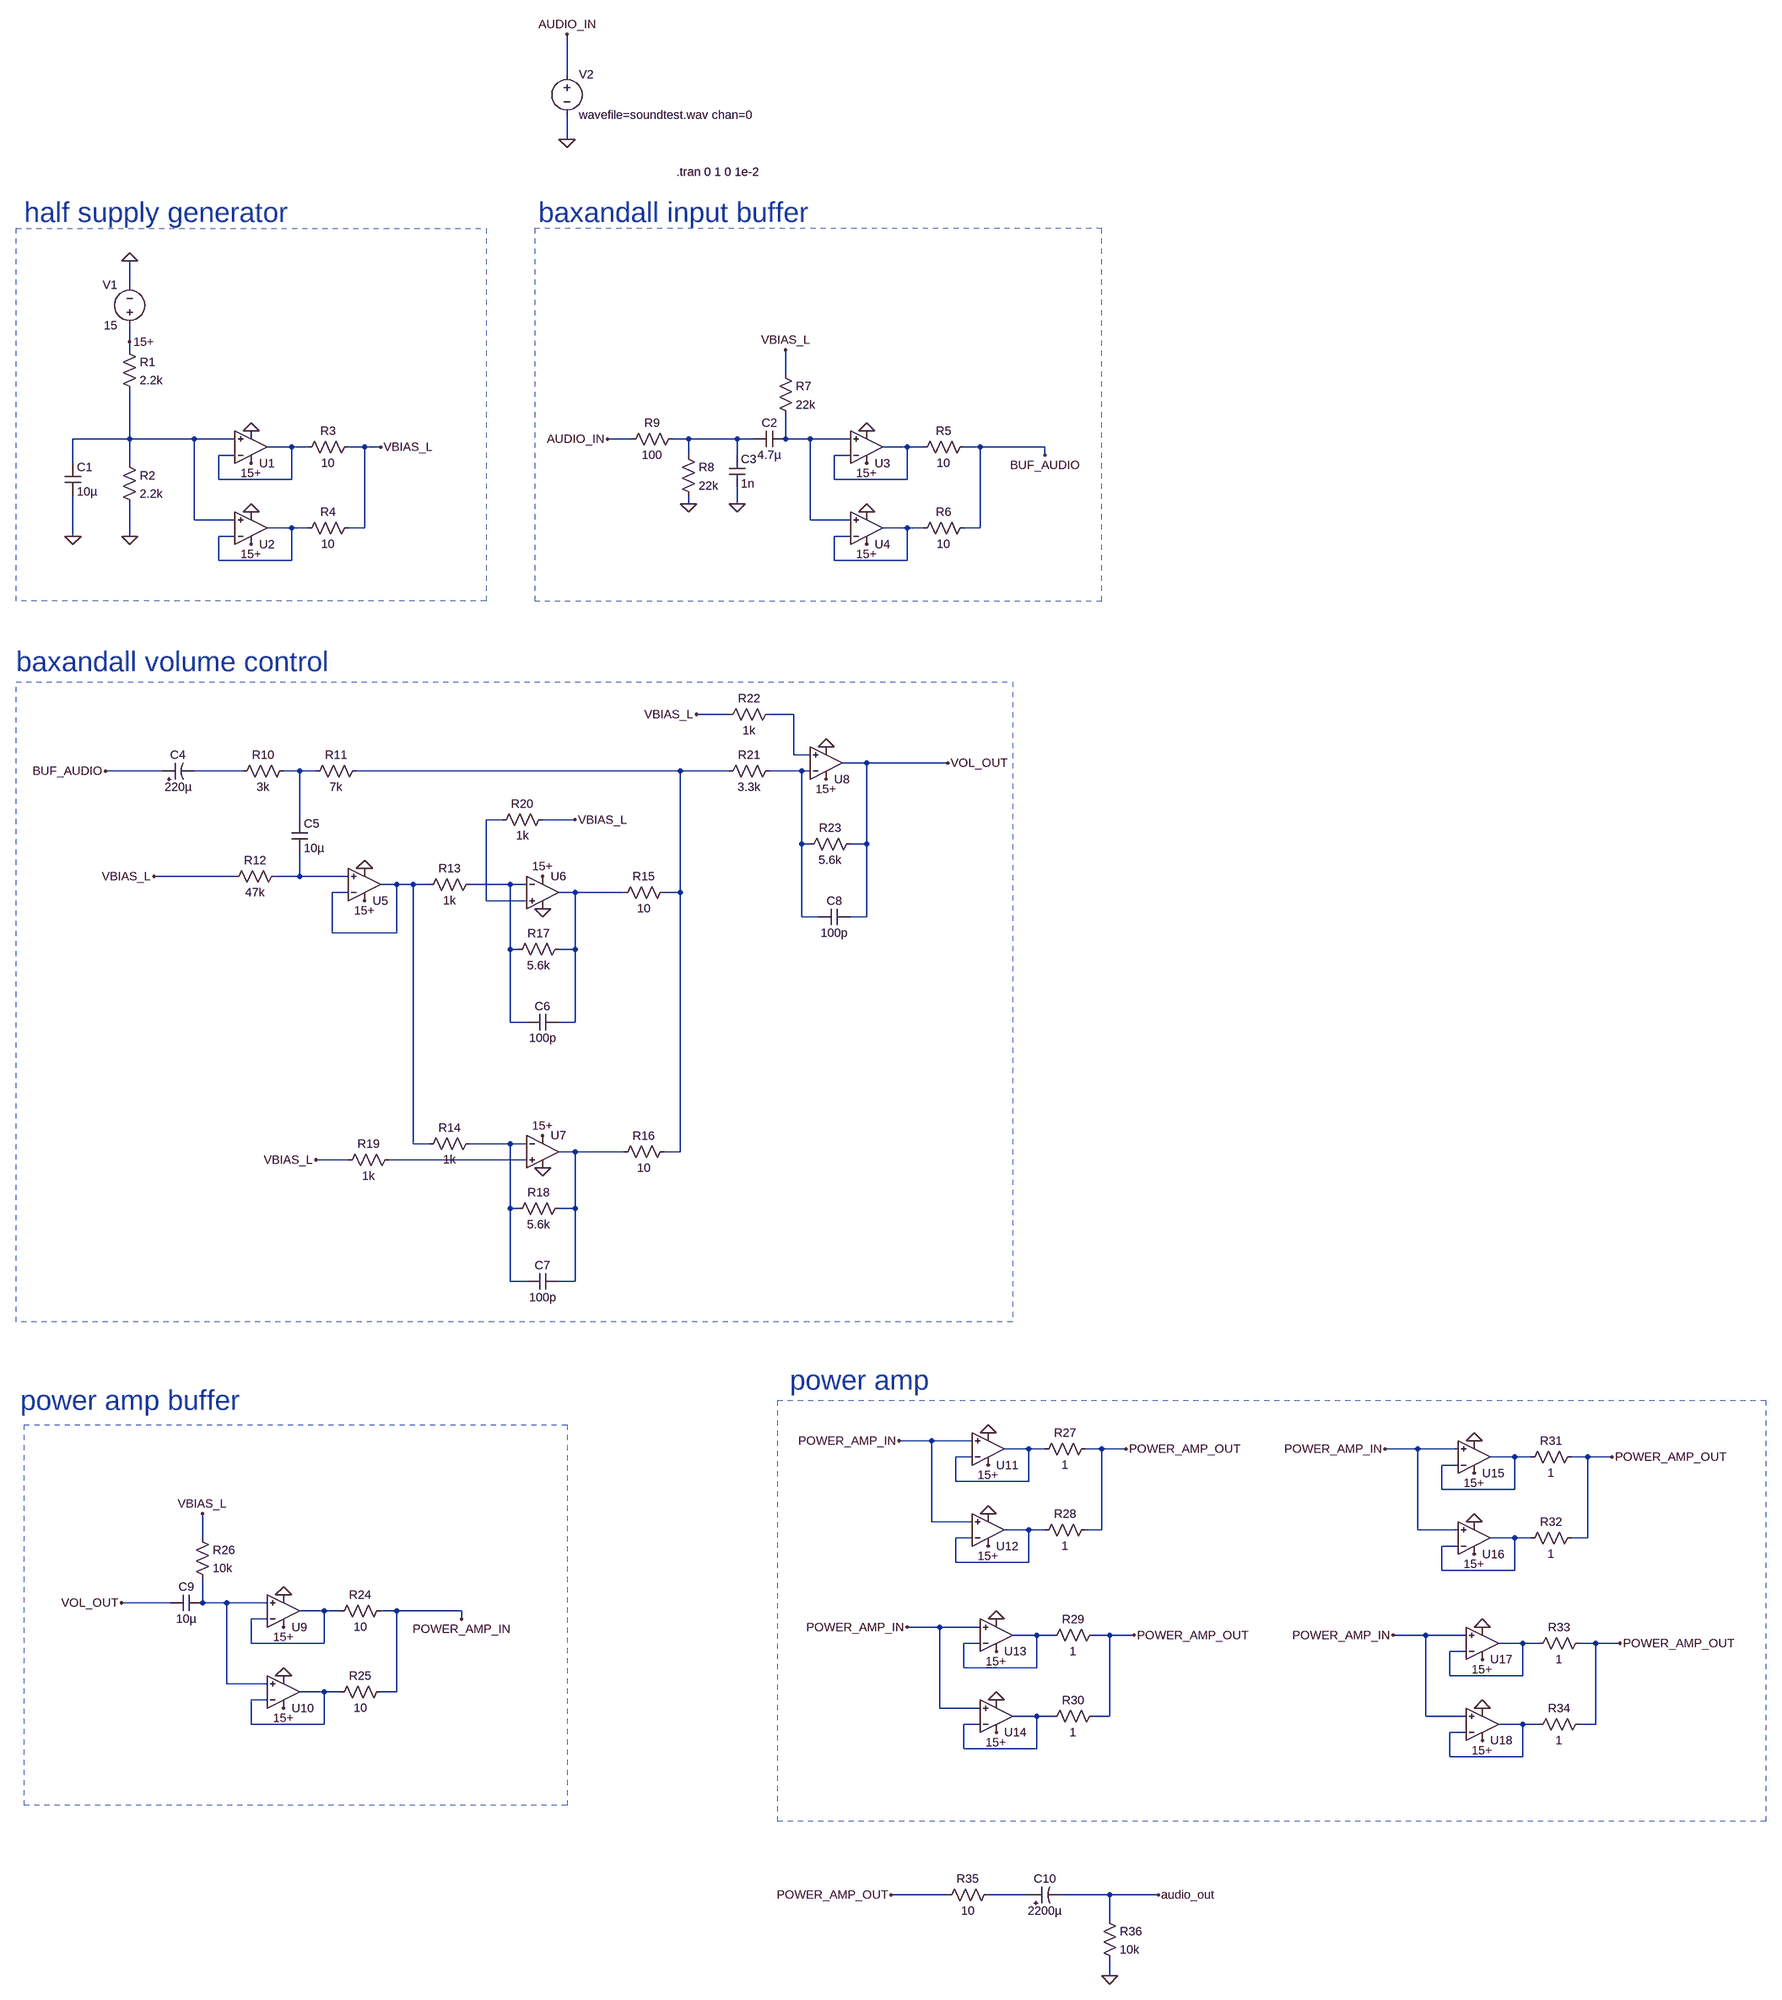
[diagram p0: schematic Amp sim backup.asc]
Amp sim backup.asc, the LTspice schematic file:
Version 4
SHEET 1 1124 932
WIRE -1248 -2864 -1248 -2944
WIRE -1248 -2736 -1248 -2784
WIRE -2112 -2448 -2112 -2496
WIRE -2112 -2336 -2112 -2368
WIRE -2112 -2320 -2112 -2336
WIRE -816 -2272 -816 -2320
WIRE -2112 -2144 -2112 -2240
WIRE -2112 -2144 -2224 -2144
WIRE -1984 -2144 -2112 -2144
WIRE -1904 -2144 -1984 -2144
WIRE -1120 -2144 -1168 -2144
WIRE -1008 -2144 -1040 -2144
WIRE -912 -2144 -1008 -2144
WIRE -880 -2144 -912 -2144
WIRE -816 -2144 -816 -2192
WIRE -768 -2144 -816 -2144
WIRE -688 -2144 -768 -2144
WIRE -1792 -2128 -1840 -2128
WIRE -1760 -2128 -1792 -2128
WIRE -1648 -2128 -1680 -2128
WIRE -1616 -2128 -1648 -2128
WIRE -576 -2128 -624 -2128
WIRE -544 -2128 -576 -2128
WIRE -432 -2128 -464 -2128
WIRE -304 -2128 -432 -2128
WIRE -1904 -2112 -1936 -2112
WIRE -1008 -2112 -1008 -2144
WIRE -912 -2112 -912 -2144
WIRE -688 -2112 -720 -2112
WIRE -304 -2112 -304 -2128
WIRE -2224 -2096 -2224 -2144
WIRE -2112 -2096 -2112 -2144
WIRE -1936 -2064 -1936 -2112
WIRE -1792 -2064 -1792 -2128
WIRE -1792 -2064 -1936 -2064
WIRE -720 -2064 -720 -2112
WIRE -576 -2064 -576 -2128
WIRE -576 -2064 -720 -2064
WIRE -1008 -2016 -1008 -2032
WIRE -912 -2016 -912 -2048
WIRE -1984 -1984 -1984 -2144
WIRE -1904 -1984 -1984 -1984
WIRE -768 -1984 -768 -2144
WIRE -688 -1984 -768 -1984
WIRE -1792 -1968 -1840 -1968
WIRE -1760 -1968 -1792 -1968
WIRE -1648 -1968 -1648 -2128
WIRE -1648 -1968 -1680 -1968
WIRE -576 -1968 -624 -1968
WIRE -544 -1968 -576 -1968
WIRE -432 -1968 -432 -2128
WIRE -432 -1968 -464 -1968
WIRE -2224 -1952 -2224 -2032
WIRE -2112 -1952 -2112 -2016
WIRE -1904 -1952 -1936 -1952
WIRE -688 -1952 -720 -1952
WIRE -1936 -1904 -1936 -1952
WIRE -1792 -1904 -1792 -1968
WIRE -1792 -1904 -1936 -1904
WIRE -720 -1904 -720 -1952
WIRE -576 -1904 -576 -1968
WIRE -576 -1904 -720 -1904
WIRE -928 -1600 -992 -1600
WIRE -800 -1600 -848 -1600
WIRE -800 -1520 -800 -1600
WIRE -768 -1520 -800 -1520
WIRE -656 -1504 -704 -1504
WIRE -496 -1504 -656 -1504
WIRE -2048 -1488 -2160 -1488
WIRE -1888 -1488 -1984 -1488
WIRE -1776 -1488 -1808 -1488
WIRE -1744 -1488 -1776 -1488
WIRE -1024 -1488 -1664 -1488
WIRE -928 -1488 -1024 -1488
WIRE -784 -1488 -848 -1488
WIRE -768 -1488 -784 -1488
WIRE -1776 -1392 -1776 -1488
WIRE -1376 -1392 -1408 -1392
WIRE -1232 -1392 -1296 -1392
WIRE -784 -1344 -784 -1488
WIRE -768 -1344 -784 -1344
WIRE -656 -1344 -656 -1504
WIRE -656 -1344 -688 -1344
WIRE -1904 -1280 -2064 -1280
WIRE -1776 -1280 -1776 -1328
WIRE -1776 -1280 -1824 -1280
WIRE -1680 -1280 -1776 -1280
WIRE -1584 -1264 -1616 -1264
WIRE -1552 -1264 -1584 -1264
WIRE -1520 -1264 -1552 -1264
WIRE -1360 -1264 -1440 -1264
WIRE -1328 -1264 -1360 -1264
WIRE -1680 -1248 -1712 -1248
WIRE -1232 -1248 -1264 -1248
WIRE -1136 -1248 -1232 -1248
WIRE -1024 -1248 -1024 -1488
WIRE -1024 -1248 -1056 -1248
WIRE -1408 -1232 -1408 -1392
WIRE -1328 -1232 -1408 -1232
WIRE -784 -1200 -784 -1344
WIRE -752 -1200 -784 -1200
WIRE -656 -1200 -656 -1344
WIRE -656 -1200 -688 -1200
WIRE -1712 -1168 -1712 -1248
WIRE -1584 -1168 -1584 -1264
WIRE -1584 -1168 -1712 -1168
WIRE -1360 -1136 -1360 -1264
WIRE -1344 -1136 -1360 -1136
WIRE -1232 -1136 -1232 -1248
WIRE -1232 -1136 -1264 -1136
WIRE -1360 -992 -1360 -1136
WIRE -1328 -992 -1360 -992
WIRE -1232 -992 -1232 -1136
WIRE -1232 -992 -1264 -992
WIRE -1552 -752 -1552 -1264
WIRE -1520 -752 -1552 -752
WIRE -1360 -752 -1440 -752
WIRE -1328 -752 -1360 -752
WIRE -1232 -736 -1264 -736
WIRE -1136 -736 -1232 -736
WIRE -1024 -736 -1024 -1248
WIRE -1024 -736 -1056 -736
WIRE -1680 -720 -1744 -720
WIRE -1328 -720 -1600 -720
WIRE -1360 -624 -1360 -752
WIRE -1344 -624 -1360 -624
WIRE -1232 -624 -1232 -736
WIRE -1232 -624 -1264 -624
WIRE -1360 -480 -1360 -624
WIRE -1328 -480 -1360 -480
WIRE -1232 -480 -1232 -624
WIRE -1232 -480 -1264 -480
WIRE -528 -160 -592 -160
WIRE -448 -160 -528 -160
WIRE -336 -144 -384 -144
WIRE -304 -144 -336 -144
WIRE -192 -144 -224 -144
WIRE -144 -144 -192 -144
WIRE 432 -144 368 -144
WIRE 512 -144 432 -144
WIRE -448 -128 -480 -128
WIRE 624 -128 576 -128
WIRE 656 -128 624 -128
WIRE 768 -128 736 -128
WIRE 816 -128 768 -128
WIRE 512 -112 480 -112
WIRE -480 -80 -480 -128
WIRE -336 -80 -336 -144
WIRE -336 -80 -480 -80
WIRE 480 -64 480 -112
WIRE 624 -64 624 -128
WIRE 624 -64 480 -64
WIRE -528 0 -528 -160
WIRE -448 0 -528 0
WIRE -336 16 -384 16
WIRE -304 16 -336 16
WIRE -192 16 -192 -144
WIRE -192 16 -224 16
WIRE 432 16 432 -144
WIRE 512 16 432 16
WIRE -1968 32 -1968 -16
WIRE -448 32 -480 32
WIRE 624 32 576 32
WIRE 656 32 624 32
WIRE 768 32 768 -128
WIRE 768 32 736 32
WIRE 512 48 480 48
WIRE -480 80 -480 32
WIRE -336 80 -336 16
WIRE -336 80 -480 80
WIRE 480 96 480 48
WIRE 624 96 624 32
WIRE 624 96 480 96
WIRE -2032 160 -2128 160
WIRE -1968 160 -1968 112
WIRE -1920 160 -1968 160
WIRE -1840 160 -1920 160
WIRE -1728 176 -1776 176
WIRE -1696 176 -1728 176
WIRE -1584 176 -1616 176
WIRE -1456 176 -1584 176
WIRE -1840 192 -1872 192
WIRE -1456 192 -1456 176
WIRE -512 208 -576 208
WIRE -432 208 -512 208
WIRE -320 224 -368 224
WIRE -288 224 -320 224
WIRE -176 224 -208 224
WIRE -128 224 -176 224
WIRE 448 224 384 224
WIRE 528 224 448 224
WIRE -1872 240 -1872 192
WIRE -1728 240 -1728 176
WIRE -1728 240 -1872 240
WIRE -432 240 -464 240
WIRE 640 240 592 240
WIRE 672 240 640 240
WIRE 784 240 752 240
WIRE 832 240 784 240
WIRE 528 256 496 256
WIRE -464 288 -464 240
WIRE -320 288 -320 224
WIRE -320 288 -464 288
WIRE 496 304 496 256
WIRE 640 304 640 240
WIRE 640 304 496 304
WIRE -1920 320 -1920 160
WIRE -1840 320 -1920 320
WIRE -1728 336 -1776 336
WIRE -1696 336 -1728 336
WIRE -1584 336 -1584 176
WIRE -1584 336 -1616 336
WIRE -1840 352 -1872 352
WIRE -512 368 -512 208
WIRE -432 368 -512 368
WIRE -320 384 -368 384
WIRE -288 384 -320 384
WIRE -176 384 -176 224
WIRE -176 384 -208 384
WIRE 448 384 448 224
WIRE 528 384 448 384
WIRE -1872 400 -1872 352
WIRE -1728 400 -1728 336
WIRE -1728 400 -1872 400
WIRE -432 400 -464 400
WIRE 640 400 592 400
WIRE 672 400 640 400
WIRE 784 400 784 240
WIRE 784 400 752 400
WIRE 528 416 496 416
WIRE -464 448 -464 400
WIRE -320 448 -320 384
WIRE -320 448 -464 448
WIRE 496 464 496 416
WIRE 640 464 640 400
WIRE 640 464 496 464
WIRE -496 752 -608 752
WIRE -336 752 -416 752
WIRE -176 752 -272 752
WIRE -80 752 -176 752
WIRE -176 800 -176 752
WIRE -176 912 -176 880
FLAG -2112 -2496 0
FLAG -2112 -1952 0
FLAG -2224 -1952 0
FLAG -1616 -2128 VBIAS_L
FLAG -2112 -2336 15+
FLAG -1872 -2096 15+
FLAG -1872 -2160 0
FLAG -1872 -2000 0
FLAG -1872 -1936 15+
FLAG -656 -2096 15+
FLAG -656 -2160 0
FLAG -656 -2000 0
FLAG -656 -1936 15+
FLAG -304 -2112 BUF_AUDIO
FLAG -912 -2016 0
FLAG -816 -2320 VBIAS_L
FLAG -1008 -2016 0
FLAG -1248 -2736 0
FLAG -1248 -2944 AUDIO_IN
FLAG -1168 -2144 AUDIO_IN
FLAG -2160 -1488 BUF_AUDIO
FLAG -2064 -1280 VBIAS_L
FLAG -1648 -1232 15+
FLAG -1648 -1296 0
FLAG -1296 -1280 15+
FLAG -1296 -1216 0
FLAG -1296 -768 15+
FLAG -1296 -704 0
FLAG -1744 -720 VBIAS_L
FLAG -1232 -1392 VBIAS_L
FLAG -736 -1472 15+
FLAG -736 -1536 0
FLAG -992 -1600 VBIAS_L
FLAG -496 -1504 VOL_OUT
FLAG -1808 208 15+
FLAG -1808 144 0
FLAG -1808 304 0
FLAG -1808 368 15+
FLAG -1456 192 POWER_AMP_IN
FLAG -1968 -16 VBIAS_L
FLAG -2128 160 VOL_OUT
FLAG -416 -112 15+
FLAG -416 -176 0
FLAG -416 -16 0
FLAG -416 48 15+
FLAG -592 -160 POWER_AMP_IN
FLAG -144 -144 POWER_AMP_OUT
FLAG -400 256 15+
FLAG -400 192 0
FLAG -400 352 0
FLAG -400 416 15+
FLAG -576 208 POWER_AMP_IN
FLAG -128 224 POWER_AMP_OUT
FLAG 544 -96 15+
FLAG 544 -160 0
FLAG 544 0 0
FLAG 544 64 15+
FLAG 368 -144 POWER_AMP_IN
FLAG 816 -128 POWER_AMP_OUT
FLAG 560 272 15+
FLAG 560 208 0
FLAG 560 368 0
FLAG 560 432 15+
FLAG 384 224 POWER_AMP_IN
FLAG 832 240 POWER_AMP_OUT
FLAG -608 752 POWER_AMP_OUT
FLAG -176 912 0
FLAG -80 752 audio_out
SYMBOL res -2128 -2336 R0
SYMATTR InstName R1
SYMATTR Value 2.2k
SYMBOL res -2128 -2112 R0
SYMATTR InstName R2
SYMATTR Value 2.2k
SYMBOL cap -2240 -2096 R0
SYMATTR InstName C1
SYMATTR Value 10µ
SYMBOL voltage -2112 -2352 R180
WINDOW 0 24 96 Left 2
WINDOW 3 24 16 Left 2
WINDOW 123 0 0 Left 0
WINDOW 39 0 0 Left 0
SYMATTR InstName V1
SYMATTR Value 15
SYMBOL res -1664 -2144 R90
WINDOW 0 0 56 VBottom 2
WINDOW 3 32 56 VTop 2
SYMATTR InstName R3
SYMATTR Value 10
SYMBOL res -1664 -1984 R90
WINDOW 0 0 56 VBottom 2
WINDOW 3 32 56 VTop 2
SYMATTR InstName R4
SYMATTR Value 10
SYMBOL res -448 -2144 R90
WINDOW 0 0 56 VBottom 2
WINDOW 3 32 56 VTop 2
SYMATTR InstName R5
SYMATTR Value 10
SYMBOL res -448 -1984 R90
WINDOW 0 0 56 VBottom 2
WINDOW 3 32 56 VTop 2
SYMATTR InstName R6
SYMATTR Value 10
SYMBOL res -832 -2288 R0
SYMATTR InstName R7
SYMATTR Value 22k
SYMBOL cap -816 -2160 R90
WINDOW 0 0 32 VBottom 2
WINDOW 3 32 32 VTop 2
SYMATTR InstName C2
SYMATTR Value 4.7µ
SYMBOL cap -928 -2112 R0
SYMATTR InstName C3
SYMATTR Value 1n
SYMBOL res -1024 -2128 R0
SYMATTR InstName R8
SYMATTR Value 22k
SYMBOL res -1024 -2160 R90
WINDOW 0 0 56 VBottom 2
WINDOW 3 32 56 VTop 2
SYMATTR InstName R9
SYMATTR Value 100
SYMBOL voltage -1248 -2880 R0
WINDOW 123 0 0 Left 0
WINDOW 39 0 0 Left 0
SYMATTR InstName V2
SYMATTR Value wavefile=soundtest.wav chan=0
SYMBOL OpAmps\\UniversalOpAmp -1872 -2128 M180
SYMATTR InstName U1
SYMBOL OpAmps\\UniversalOpAmp -1872 -1968 M180
SYMATTR InstName U2
SYMBOL OpAmps\\UniversalOpAmp -656 -2128 M180
SYMATTR InstName U3
SYMBOL OpAmps\\UniversalOpAmp -656 -1968 M180
SYMATTR InstName U4
SYMBOL polcap -2048 -1472 R270
WINDOW 0 32 32 VTop 2
WINDOW 3 0 32 VBottom 2
SYMATTR InstName C4
SYMATTR Value 220µ
SYMBOL res -1792 -1504 R90
WINDOW 0 0 56 VBottom 2
WINDOW 3 32 56 VTop 2
SYMATTR InstName R10
SYMATTR Value 3k
SYMBOL res -1648 -1504 R90
WINDOW 0 0 56 VBottom 2
WINDOW 3 32 56 VTop 2
SYMATTR InstName R11
SYMATTR Value 7k
SYMBOL cap -1792 -1392 R0
SYMATTR InstName C5
SYMATTR Value 10µ
SYMBOL res -1808 -1296 R90
WINDOW 0 0 56 VBottom 2
WINDOW 3 32 56 VTop 2
SYMATTR InstName R12
SYMATTR Value 47k
SYMBOL OpAmps\\UniversalOpAmp -1648 -1264 M180
SYMATTR InstName U5
SYMBOL res -1424 -1280 R90
WINDOW 0 0 56 VBottom 2
WINDOW 3 32 56 VTop 2
SYMATTR InstName R13
SYMATTR Value 1k
SYMBOL OpAmps\\UniversalOpAmp -1296 -1248 R0
SYMATTR InstName U6
SYMBOL res -1424 -768 R90
WINDOW 0 0 56 VBottom 2
WINDOW 3 32 56 VTop 2
SYMATTR InstName R14
SYMATTR Value 1k
SYMBOL res -1040 -1264 R90
WINDOW 0 0 56 VBottom 2
WINDOW 3 32 56 VTop 2
SYMATTR InstName R15
SYMATTR Value 10
SYMBOL res -1040 -752 R90
WINDOW 0 0 56 VBottom 2
WINDOW 3 32 56 VTop 2
SYMATTR InstName R16
SYMATTR Value 10
SYMBOL cap -1264 -1008 R90
WINDOW 0 0 32 VBottom 2
WINDOW 3 32 32 VTop 2
SYMATTR InstName C6
SYMATTR Value 100p
SYMBOL res -1248 -1152 R90
WINDOW 0 0 56 VBottom 2
WINDOW 3 32 56 VTop 2
SYMATTR InstName R17
SYMATTR Value 5.6k
SYMBOL OpAmps\\UniversalOpAmp -1296 -736 R0
SYMATTR InstName U7
SYMBOL cap -1264 -496 R90
WINDOW 0 0 32 VBottom 2
WINDOW 3 32 32 VTop 2
SYMATTR InstName C7
SYMATTR Value 100p
SYMBOL res -1248 -640 R90
WINDOW 0 0 56 VBottom 2
WINDOW 3 32 56 VTop 2
SYMATTR InstName R18
SYMATTR Value 5.6k
SYMBOL res -1584 -736 R90
WINDOW 0 0 56 VBottom 2
WINDOW 3 32 56 VTop 2
SYMATTR InstName R19
SYMATTR Value 1k
SYMBOL res -1392 -1376 R270
WINDOW 0 32 56 VTop 2
WINDOW 3 0 56 VBottom 2
SYMATTR InstName R20
SYMATTR Value 1k
SYMBOL res -832 -1504 R90
WINDOW 0 0 56 VBottom 2
WINDOW 3 32 56 VTop 2
SYMATTR InstName R21
SYMATTR Value 3.3k
SYMBOL OpAmps\\UniversalOpAmp -736 -1504 M180
SYMATTR InstName U8
SYMBOL res -832 -1616 R90
WINDOW 0 0 56 VBottom 2
WINDOW 3 32 56 VTop 2
SYMATTR InstName R22
SYMATTR Value 1k
SYMBOL cap -688 -1216 R90
WINDOW 0 0 32 VBottom 2
WINDOW 3 32 32 VTop 2
SYMATTR InstName C8
SYMATTR Value 100p
SYMBOL res -672 -1360 R90
WINDOW 0 0 56 VBottom 2
WINDOW 3 32 56 VTop 2
SYMATTR InstName R23
SYMATTR Value 5.6k
SYMBOL res -1600 160 R90
WINDOW 0 0 56 VBottom 2
WINDOW 3 32 56 VTop 2
SYMATTR InstName R24
SYMATTR Value 10
SYMBOL res -1600 320 R90
WINDOW 0 0 56 VBottom 2
WINDOW 3 32 56 VTop 2
SYMATTR InstName R25
SYMATTR Value 10
SYMBOL res -1984 16 R0
SYMATTR InstName R26
SYMATTR Value 10k
SYMBOL cap -1968 144 R90
WINDOW 0 0 32 VBottom 2
WINDOW 3 32 32 VTop 2
SYMATTR InstName C9
SYMATTR Value 10µ
SYMBOL OpAmps\\UniversalOpAmp -1808 176 M180
SYMATTR InstName U9
SYMBOL OpAmps\\UniversalOpAmp -1808 336 M180
SYMATTR InstName U10
SYMBOL res -208 -160 R90
WINDOW 0 0 56 VBottom 2
WINDOW 3 32 56 VTop 2
SYMATTR InstName R27
SYMATTR Value 1
SYMBOL res -208 0 R90
WINDOW 0 0 56 VBottom 2
WINDOW 3 32 56 VTop 2
SYMATTR InstName R28
SYMATTR Value 1
SYMBOL OpAmps\\UniversalOpAmp -416 -144 M180
SYMATTR InstName U11
SYMBOL OpAmps\\UniversalOpAmp -416 16 M180
SYMATTR InstName U12
SYMBOL res -192 208 R90
WINDOW 0 0 56 VBottom 2
WINDOW 3 32 56 VTop 2
SYMATTR InstName R29
SYMATTR Value 1
SYMBOL res -192 368 R90
WINDOW 0 0 56 VBottom 2
WINDOW 3 32 56 VTop 2
SYMATTR InstName R30
SYMATTR Value 1
SYMBOL OpAmps\\UniversalOpAmp -400 224 M180
SYMATTR InstName U13
SYMBOL OpAmps\\UniversalOpAmp -400 384 M180
SYMATTR InstName U14
SYMBOL res 752 -144 R90
WINDOW 0 0 56 VBottom 2
WINDOW 3 32 56 VTop 2
SYMATTR InstName R31
SYMATTR Value 1
SYMBOL res 752 16 R90
WINDOW 0 0 56 VBottom 2
WINDOW 3 32 56 VTop 2
SYMATTR InstName R32
SYMATTR Value 1
SYMBOL OpAmps\\UniversalOpAmp 544 -128 M180
SYMATTR InstName U15
SYMBOL OpAmps\\UniversalOpAmp 544 32 M180
SYMATTR InstName U16
SYMBOL res 768 224 R90
WINDOW 0 0 56 VBottom 2
WINDOW 3 32 56 VTop 2
SYMATTR InstName R33
SYMATTR Value 1
SYMBOL res 768 384 R90
WINDOW 0 0 56 VBottom 2
WINDOW 3 32 56 VTop 2
SYMATTR InstName R34
SYMATTR Value 1
SYMBOL OpAmps\\UniversalOpAmp 560 240 M180
SYMATTR InstName U17
SYMBOL OpAmps\\UniversalOpAmp 560 400 M180
SYMATTR InstName U18
SYMBOL res -400 736 R90
WINDOW 0 0 56 VBottom 2
WINDOW 3 32 56 VTop 2
SYMATTR InstName R35
SYMATTR Value 10
SYMBOL polcap -336 768 R270
WINDOW 0 32 32 VTop 2
WINDOW 3 0 32 VBottom 2
SYMATTR InstName C10
SYMATTR Value 2200µ
SYMBOL res -192 784 R0
SYMATTR InstName R36
SYMATTR Value 10k
TEXT -1032 -2672 Left 2 !.tran 0 1 0 1e-2
TEXT -2320 -2592 Left 5 ;half supply generator
TEXT -1304 -2592 Left 5 ;baxandall input buffer
TEXT -2336 -1704 Left 5 ;baxandall volume control
TEXT -2328 -240 Left 5 ;power amp buffer
TEXT -808 -280 Left 5 ;power amp
RECTANGLE Normal -1408 -1824 -2336 -2560 2
RECTANGLE Normal -192 -2560 -1312 -1824 2
RECTANGLE Normal -368 -400 -2336 -1664 2
RECTANGLE Normal -1248 560 -2320 -192 2
RECTANGLE Normal 1120 592 -832 -240 2

The netlist it stands for:
* Amp sim backup.asc
R1 15+ N001 2.2k
R2 N001 0 2.2k
C1 N001 0 10µ
V1 15+ 0 15
R3 VBIAS_L N004 10
R4 VBIAS_L N006 10
R5 BUF_AUDIO N005 10
R6 BUF_AUDIO N007 10
R7 VBIAS_L N003 22k
C2 N003 N002 4.7µ
C3 N002 0 1n
R8 N002 0 22k
R9 N002 AUDIO_IN 100
V2 AUDIO_IN 0 wavefile=soundtest.wav chan=0
XU1 N001 N004 15+ 0 N004 level1 Avol=1Meg GBW=10Meg Vos=0 En=0 Enk=0 In=0 Ink=0 Rin=500Meg  ; pins In+ In- V+ V- OUT
XU2 N001 N006 15+ 0 N006 level1 Avol=1Meg GBW=10Meg Vos=0 En=0 Enk=0 In=0 Ink=0 Rin=500Meg  ; pins In+ In- V+ V- OUT
XU3 N003 N005 15+ 0 N005 level1 Avol=1Meg GBW=10Meg Vos=0 En=0 Enk=0 In=0 Ink=0 Rin=500Meg  ; pins In+ In- V+ V- OUT
XU4 N003 N007 15+ 0 N007 level1 Avol=1Meg GBW=10Meg Vos=0 En=0 Enk=0 In=0 Ink=0 Rin=500Meg  ; pins In+ In- V+ V- OUT
C4 BUF_AUDIO N009 220µ
R10 N010 N009 3k
R11 N011 N010 7k
C5 N010 N014 10µ
R12 N014 VBIAS_L 47k
XU5 N014 N015 15+ 0 N015 level1 Avol=1Meg GBW=10Meg Vos=0 En=0 Enk=0 In=0 Ink=0 Rin=500Meg  ; pins In+ In- V+ V- OUT
R13 N016 N015 1k
XU6 N013 N016 15+ 0 N017 level1 Avol=1Meg GBW=10Meg Vos=0 En=0 Enk=0 In=0 Ink=0 Rin=500Meg  ; pins In+ In- V+ V- OUT
R14 N018 N015 1k
R15 N011 N017 10
R16 N011 N019 10
C6 N017 N016 100p
R17 N017 N016 5.6k
XU7 N020 N018 15+ 0 N019 level1 Avol=1Meg GBW=10Meg Vos=0 En=0 Enk=0 In=0 Ink=0 Rin=500Meg  ; pins In+ In- V+ V- OUT
C7 N019 N018 100p
R18 N019 N018 5.6k
R19 N020 VBIAS_L 1k
R20 N013 VBIAS_L 1k
R21 N012 N011 3.3k
XU8 N008 N012 15+ 0 VOL_OUT level1 Avol=1Meg GBW=10Meg Vos=0 En=0 Enk=0 In=0 Ink=0 Rin=500Meg  ; pins In+ In- V+ V- OUT
R22 N008 VBIAS_L 1k
C8 VOL_OUT N012 100p
R23 VOL_OUT N012 5.6k
R24 POWER_AMP_IN N026 10
R25 POWER_AMP_IN N029 10
R26 VBIAS_L N025 10k
C9 N025 VOL_OUT 10µ
XU9 N025 N026 15+ 0 N026 level1 Avol=1Meg GBW=10Meg Vos=0 En=0 Enk=0 In=0 Ink=0 Rin=500Meg  ; pins In+ In- V+ V- OUT
XU10 N025 N029 15+ 0 N029 level1 Avol=1Meg GBW=10Meg Vos=0 En=0 Enk=0 In=0 Ink=0 Rin=500Meg  ; pins In+ In- V+ V- OUT
R27 POWER_AMP_OUT N021 1
R28 POWER_AMP_OUT N023 1
XU11 POWER_AMP_IN N021 15+ 0 N021 level1 Avol=1Meg GBW=10Meg Vos=0 En=0 Enk=0 In=0 Ink=0 Rin=500Meg  ; pins In+ In- V+ V- OUT
XU12 POWER_AMP_IN N023 15+ 0 N023 level1 Avol=1Meg GBW=10Meg Vos=0 En=0 Enk=0 In=0 Ink=0 Rin=500Meg  ; pins In+ In- V+ V- OUT
R29 POWER_AMP_OUT N027 1
R30 POWER_AMP_OUT N030 1
XU13 POWER_AMP_IN N027 15+ 0 N027 level1 Avol=1Meg GBW=10Meg Vos=0 En=0 Enk=0 In=0 Ink=0 Rin=500Meg  ; pins In+ In- V+ V- OUT
XU14 POWER_AMP_IN N030 15+ 0 N030 level1 Avol=1Meg GBW=10Meg Vos=0 En=0 Enk=0 In=0 Ink=0 Rin=500Meg  ; pins In+ In- V+ V- OUT
R31 POWER_AMP_OUT N022 1
R32 POWER_AMP_OUT N024 1
XU15 POWER_AMP_IN N022 15+ 0 N022 level1 Avol=1Meg GBW=10Meg Vos=0 En=0 Enk=0 In=0 Ink=0 Rin=500Meg  ; pins In+ In- V+ V- OUT
XU16 POWER_AMP_IN N024 15+ 0 N024 level1 Avol=1Meg GBW=10Meg Vos=0 En=0 Enk=0 In=0 Ink=0 Rin=500Meg  ; pins In+ In- V+ V- OUT
R33 POWER_AMP_OUT N028 1
R34 POWER_AMP_OUT N031 1
XU17 POWER_AMP_IN N028 15+ 0 N028 level1 Avol=1Meg GBW=10Meg Vos=0 En=0 Enk=0 In=0 Ink=0 Rin=500Meg  ; pins In+ In- V+ V- OUT
XU18 POWER_AMP_IN N031 15+ 0 N031 level1 Avol=1Meg GBW=10Meg Vos=0 En=0 Enk=0 In=0 Ink=0 Rin=500Meg  ; pins In+ In- V+ V- OUT
R35 N032 POWER_AMP_OUT 10
C10 N032 audio_out 2200µ
R36 audio_out 0 10k
.tran 0 1 0 1e-2
* half supply generator
* baxandall input buffer
* baxandall volume control
* power amp buffer
* power amp
.lib UniversalOpAmp1.lib
.backanno
.end